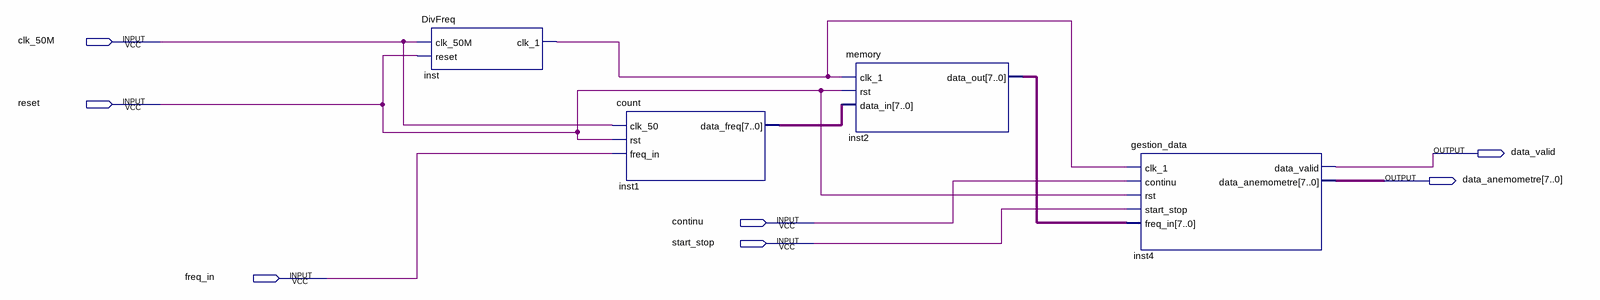
[diagram p0: schematic sheet]
// Quartus schematic counting.bdf as structural Verilog: 4 symbols, 7 pins
module counting (
  input  clk_50M,
  input  reset,
  input  continu,
  input  start_stop,
  input  freq_in,
  output data_valid,
  output [7:0] data_anemometre
);

  wire inst_clk_1;
  wire [7:0] inst1_data_freq, inst2_data_out;

  DivFreq inst (.clk_50M(clk_50M), .reset(reset), .clk_1(inst_clk_1));
  count inst1 (.clk_50(clk_50M), .rst(reset), .freq_in(freq_in), .data_freq(inst1_data_freq));
  memory inst2 (.clk_1(inst_clk_1), .rst(reset), .data_in(inst1_data_freq), .data_out(inst2_data_out));
  gestion_data inst4 (
    .clk_1(inst_clk_1), .continu(continu), .rst(reset), .start_stop(start_stop), .freq_in(inst2_data_out),
    .data_valid(data_valid), .data_anemometre(data_anemometre));
endmodule
